# Altium schematic sheet Title.SchDoc
size Tabloid; Size: 11x17; Sheet_Name: Sheet Description
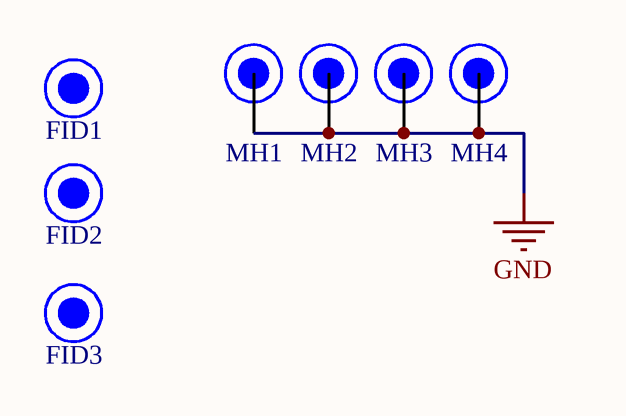
[diagram p0: Title.SchDoc]

## Parts
FID1  Fiducial 1mm  [FID_1MM]  (value not drawn)
FID2  Fiducial 1mm  [FID_1MM]  (value not drawn)
FID3  Fiducial 1mm  [FID_1MM]  (value not drawn)
MH1  Mounting Hole 6/32  [MH_ENG_6-32]  (value not drawn)
MH2  Mounting Hole 6/32  [MH_ENG_6-32]  (value not drawn)
MH3  Mounting Hole 6/32  [MH_ENG_6-32]  (value not drawn)
MH4  Mounting Hole 6/32  [MH_ENG_6-32]  (value not drawn)

## Nets
GND: MH1.1 MH2.1 MH3.1 MH4.1

## Notes on the sheet
- Revision history
- Package size conversion
- Metric
- 1005
- 1608
- Imperial
- 0402
- 0603
- Revision
- 2012
- 3216
- 0805
- 1206
- 3225
- 6432
- 1210
- 2512
- Date :
- Project Title
- Global Project
- Size
- Group
- Date
- Sheet
- of
- Filename
- Designers

## Library data of the parts
FID1-FID3 = FID - 1MM
MH1-MH4 = MH - 6-32